# Altium schematic sheet UART_CHANGER.SchDoc
size A4; DocumentNumber: 1; SheetNumber: 1; SheetTotal: 2
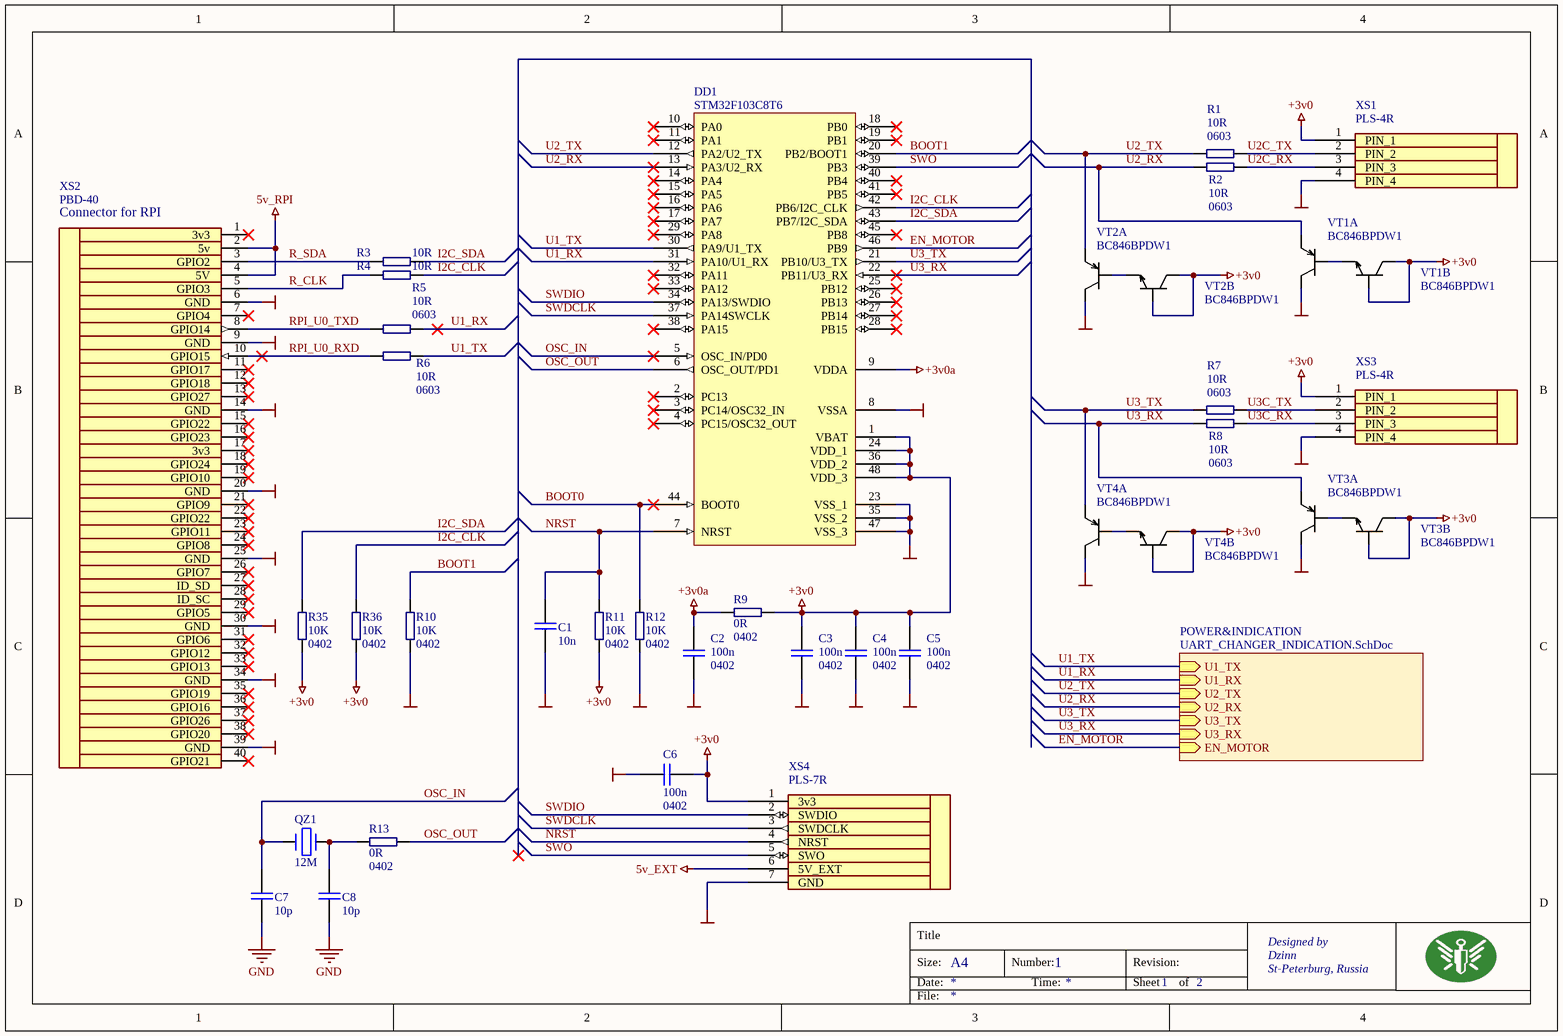
[diagram p0: UART_CHANGER.SchDoc]

## Parts
C1  10n  [0402]
C2  100n  [0402]
C3  100n  [0402]
C4  100n  [0402]
C5  100n  [0402]
C6  100n  [0402]
C7  10p  [0402]
C8  10p  [0402]
DD1  STM32F103С8T6  [LQFP-48-ST]
QZ1  12M  [DSX221G]
R1  10R  [0603]
R2  10R  [0603]
R3  10R  [0603]
R4  10R  [0603]
R5  10R  [0603]
R6  10R  [0603]
R7  10R  [0603]
R8  10R  [0603]
R9  0R  [0402]
R10  10K  [0402]
R11  10K  [0402]
R12  10K  [0402]
R13  0R  [0402]
R35  10K  [0402]
R36  10K  [0402]
VT1  BC846BPDW1  [SOT-363]  (parts A,B of 2)
VT2  BC846BPDW1  [SOT-363]  (parts A,B of 2)
VT3  BC846BPDW1  [SOT-363]  (parts A,B of 2)
VT4  BC846BPDW1  [SOT-363]  (parts A,B of 2)
XS1  PLS-4R  [PLS-4R]
XS2  PBD-40  [PBВ-40]
XS3  PLS-4R  [PLS-4R]
XS4  PLS-7R  [PLS-7R]

## Sub-sheets
POWER&INDICATION = UART_CHANGER_INDICATION.SchDoc: U2_TX (in), U1_RX (in), U2_RX (in), U3_RX (in), U3_TX (in), U1_TX (in), EN_MOTOR (in)

## Nets
5v_EXT: XS4.6(5V_EXT)
5v_RPI: XS2.2(5v) XS2.4(5V)
+3v0: C3.1 C4.1 C5.1 C6.2 DD1.1(VBAT) DD1.24(VDD_1) DD1.36(VDD_2) DD1.48(VDD_3) R9.1 R11.1 R35.1 R36.1 VT1.2 VT1.6 VT2.2 VT2.6 VT3.2 VT3.6 VT4.2 VT4.6 XS1.1(PIN_1) XS3.1(PIN_1) XS4.1(3v3)
+3v0a: C2.1 DD1.9(VDDA) R9.2
GND: C1.2 C2.2 C3.2 C4.2 C5.2 C6.1 C7.2 C8.2 DD1.8(VSSA) DD1.23(VSS_1) DD1.35(VSS_2) DD1.47(VSS_3) R10.1 R12.1 VT1.3 VT2.3 VT3.3 VT4.3 XS1.4(PIN_4) XS2.6(GND) XS2.9(GND) XS2.14(GND) XS2.20(GND) XS2.25(GND) XS2.30(GND) XS2.34(GND) XS2.39(GND) XS3.4(PIN_4) XS4.7(GND)
BOOT0: DD1.44(BOOT0) R12.2
BOOT1: DD1.20(PB2/BOOT1) R10.2
EN_MOTOR: DD1.46(PB9) ; sheet POWER&INDICATION/EN_MOTOR
I2C_CLK: DD1.42(PB6/I2C_CLK) R4.1 R36.2
I2C_SDA: DD1.43(PB7/I2C_SDA) R3.1 R35.2
NRST: C1.1 DD1.7(NRST) R11.2 XS4.4(NRST)
OSC_IN: C7.1 DD1.5(OSC_IN/PD0) QZ1.3
OSC_OUT: DD1.6(OSC_OUT/PD1) R13.1
R_CLK: R4.2 XS2.5(GPIO3)
R_SDA: R3.2 XS2.3(GPIO2)
RPI_U0_RXD: R6.2 XS2.10(GPIO15)
RPI_U0_TXD: R5.2 XS2.8(GPIO14)
SWDCLK: DD1.37(PA14SWCLK) XS4.3(SWDCLK)
SWDIO: DD1.34(PA13/SWDIO) XS4.2(SWDIO)
SWO: DD1.39(PB3) XS4.5(SWO)
U1_RX: DD1.31(PA10/U1_RX) R5.1 ; sheet POWER&INDICATION/U1_RX
U1_TX: DD1.30(PA9/U1_TX) R6.1 ; sheet POWER&INDICATION/U1_TX
U2_RX: DD1.13(PA3/U2_RX) R2.2 VT1.4 ; sheet POWER&INDICATION/U2_RX
U2_TX: DD1.12(PA2/U2_TX) R1.2 VT2.4 ; sheet POWER&INDICATION/U2_TX
U2C_RX: R2.1 XS1.3(PIN_3)
U2C_TX: R1.1 XS1.2(PIN_2)
U3_RX: DD1.22(PB11/U3_RX) R8.2 VT3.4 ; sheet POWER&INDICATION/U3_RX
U3_TX: DD1.21(PB10/U3_TX) R7.2 VT4.4 ; sheet POWER&INDICATION/U3_TX
U3C_RX: R8.1 XS3.3(PIN_3)
U3C_TX: R7.1 XS3.2(PIN_2)
NetC8_1: C8.1 QZ1.1 R13.2
NetVT1_1: VT1.1 VT1.5
NetVT2_1: VT2.1 VT2.5
NetVT3_1: VT3.1 VT3.5
NetVT4_1: VT4.1 VT4.5

Not connected (* = marked no-connect by the designer): DD1 2(PC13)* 3(PC14/OSC32_IN)* 4(PC15/OSC32_OUT)* 10(PA0)* 11(PA1)* 14(PA4)* 15(PA5)* 16(PA6)* 17(PA7)* 18(PB0)* 19(PB1)* 25(PB12)* 26(PB13)* 27(PB14)* 28(PB15)* 29(PA8)* 32(PA11)* 33(PA12)* 38(PA15)* 40(PB4)* 41(PB5)* 45(PB8)*; XS2 1(3v3)* 7(GPIO4)* 11(GPIO17)* 12(GPIO18)* 13(GPIO27)* 15(GPIO22)* 16(GPIO23)* 17(3v3)* 18(GPIO24)* 19(GPIO10)* 21(GPIO9)* 22(GPIO22)* 23(GPIO11)* 24(GPIO8)* 26(GPIO7)* 27(ID_SD)* 28(ID_SC)* 29(GPIO5)* 31(GPIO6)* 32(GPIO12)* 33(GPIO13)* 35(GPIO19)* 36(GPIO16)* 37(GPIO26)* 38(GPIO20)* 40(GPIO21)*

## Notes on the sheet
- (near XS2) Connector for RPI
- Title
- Size:
- Date:
- A4
- Number:
- Time:
- Revision:
- Sheet
- of
- Designed by
- Dzinn
- St-Peterburg, Russia
- File:

## Library data of the parts
C1 C7 C8 = C000001: CAP 0402 100n; Manufacturer: Murata; Check Footprint: A; Tolerance: ±1%; Voltage: 100V; Part Number: C000001; Check Symbol: A; Operating Temperature: -55°C ~ 155°C; Package: 0
  C1: Value: 10n
  C7 C8: Value: 10p
C2-C6 = C000001: CAP 0402 100n; Manufacturer: Murata; Check Footprint: A; Tolerance: ±1%; Voltage: 10V; Part Number: C000001; Check Symbol: A; Value: 100n; Operating Temperature: -55°C ~ 155°C; Package: 0402
DD1 = U00026: 32 Bit 72Mhz ARM MCU; Part Number: U00026; Manufacturer: ST; Check Footprint: A; Check Symbol: A; Value: STM32F103С8T6; Operating Temperature: -40°C ~ 85°C; Package: LQFP-48-ST
QZ1 = QZ00002: 12M SMD QUARTZ; Manufacturer: NDK; Check Footprint: A; Part Number: QZ00002; Check Symbol: A; Value: 12M; Package: DSX221G
R1-R8 = R000195: RES SMD; Manufacturer: Rohm Semiconductor; Check Footprint: A; Tolerance: ±1%; Power: 0,1W; Temperature Coefficient: ±200ppm/°C; Part Number: R000195; Check Symbol: A; HelpURL: http://rohmfs.rohm.com/en/products/databook/datasheet/passive/resistor/chip_resistor/esr.pdf; Value: 10R; Operating Temperature: -55°C ~ 155°C; Package: 0603
R9 R13 = R000001: RES SMD; Manufacturer: Rohm Semiconductor; Check Footprint: A; Tolerance: ±1%; Power: 0.063W; Temperature Coefficient: ±200ppm/°C; Part Number: R000001; Check Symbol: A; HelpURL: http://rohmfs.rohm.com/en/products/databook/datasheet/passive/resistor/chip_resistor/esr.pdf; Value: 0R; Operating Temperature: -55°C ~ 155°C; Package: 0402
R10-R12 R35 R36 = R000098: RES SMD; Manufacturer: Rohm Semiconductor; Check Footprint: A; Tolerance: ±1%; Power: 0; Temperature Coefficient: ±200ppm/°C; Part Number: R000098; Check Symbol: A; HelpURL: http://rohmfs.rohm.com/en/products/databook/datasheet/passive/resistor/chip_resistor/esr.pdf; Value: 10K; Operating Temperature: 0; Package: 0402
VT1-VT4 = VT00002: 60V 100mA PNP/NPN Transistor; Manufacturer: ON; Check Footprint: A; Power: 1,380W; Part Number: VT00002; Check Symbol: A; HelpURL: http://shop.electronshik.ru/z/Datasheet/B/BC846BPDW1T1-Dhj.pdf; Value: BC846BPDW1; Operating Temperature: -55°C ~ 150°C; Package: SOT-363
XS1 XS3 = XS00013: 4 PIN PLS right angle; Manufacturer: WE; Check Footprint: A; Part Number: XS00013; Check Symbol: A; Value: PLS-4R; Package: PLS
XS2 = XS00012: Check Footprint: A; Part Number: XS00012; Check Symbol: A; Value: PBD-40; Package: PBD-40
XS4 = XS00003: 7 PIN PLS right angle; Manufacturer: TE; Check Footprint: A; Part Number: XS00003; Check Symbol: A; Value: PLS-7R; Package: PLS